# EAGLE design Hava Durumu İst V1.0 (EAGLE 9.6.2)
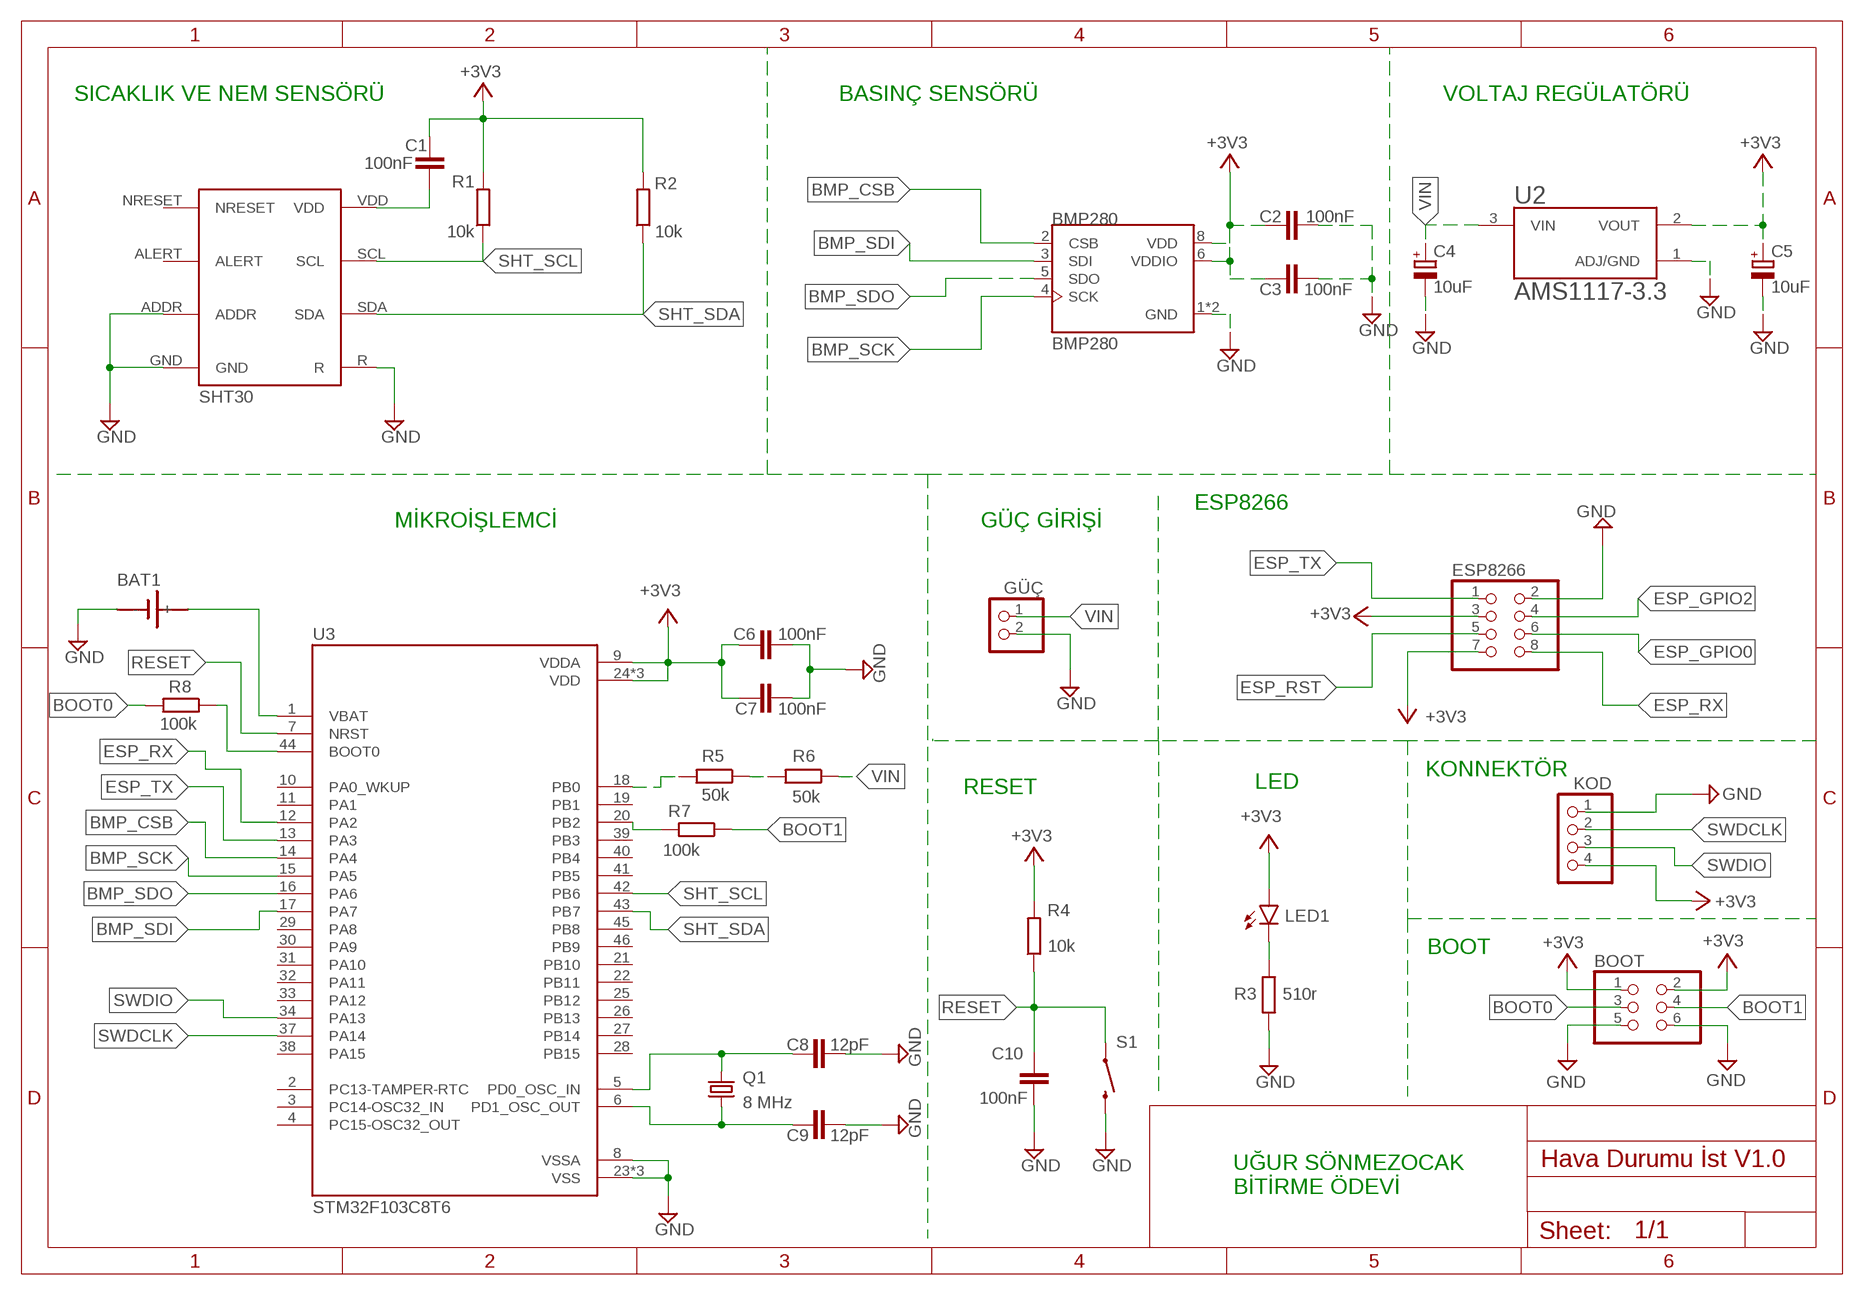
[diagram p0: schematic, sheet 1]

## Parts
BAT1  SN2032  [SN2032]
BMP280  BMP280  [XDCR_BMP280]
BOOT  PINHD-2X3  [2X03]
C1  100nF  C-EUC0805  [C0805]
C2  100nF  C-EUC0805  [C0805]
C3  100nF  C-EUC0805  [C0805]
C4  10uF  CPOL-EUSMCP  [SMC_P]
C5  10uF  CPOL-EUSMCP  [SMC_P]
C6  100nF  C-EUC0805  [C0805]
C7  100nF  C-EUC0805  [C0805]
C8  12pF  C-EUC0805  [C0805]
C9  12pF  C-EUC0805  [C0805]
C10  100nF  C-EUC0805  [C0805]
ESP8266  PINHD-2X4  [2X04]
GÜÇ  PINHD-1X2  [1X02]
KOD  PINHD-1X4/90  [1X04/90]
LED1  LEDCHIP-LED0805  [CHIP-LED0805]
Q1  8 MHz  CRYSTALHC49UP  [HC49UP]
R1  10k  R-EU_R0805  [R0805]
R2  10k  R-EU_R0805  [R0805]
R3  510r  R-EU_R0805  [R0805]
R4  10k  R-EU_R0805  [R0805]
R5  50k  R-EU_R0805  [R0805]
R6  50k  R-EU_R0805  [R0805]
R7  100k  R-EU_R0805  [R0805]
R8  100k  R-EU_R0805  [R0805]
S1  MOMENTARY-SWITCH-SPST-PTH-6.0MM  [TACTILE_SWITCH_PTH_6.0MM]
U2  AMS1117-3.3  [SOT229P700X180-4N]
U3  STM32F103C8T6  [QFP50P900X900X160-48N]
U$1  SHT30  [SON50P250X250X90-9T100X170N]

## Nets
+3V3: BMP280.6(VDDIO) BMP280.8(VDD) BOOT.1 BOOT.2 C1.1 C2.1 C3.1 C5.+ C6.1 C7.1 ESP8266.3 ESP8266.7 KOD.4 LED1.A R1.2 R2.2 R4.2 U2.2(VOUT) U3.9(VDDA) U3.24(VDD) U3.36(VDD) U3.48(VDD)
BMP_CSB: BMP280.2(CSB) U3.14(PA4)
BMP_SCK: BMP280.4(SCK) U3.15(PA5)
BMP_SDI: BMP280.3(SDI) U3.17(PA7)
BMP_SDO: BMP280.5(SDO) U3.16(PA6)
BOOT0: BOOT.3 R8.2
BOOT1: BOOT.4 R7.1
ESP_GPIO0: ESP8266.6
ESP_GPIO2: ESP8266.4
ESP_RST: ESP8266.5
ESP_RX: ESP8266.8 U3.12(PA2)
ESP_TX: ESP8266.1 U3.13(PA3)
GND: BAT1.- BMP280.1(GND) BMP280.7(GND) BOOT.5 BOOT.6 C2.2 C3.2 C4.- C5.- C6.2 C7.2 C8.2 C9.2 C10.1 ESP8266.2 GÜÇ.2 KOD.1 R3.1 S1.3 U2.1(ADJ/GND) U3.8(VSSA) U3.23(VSS) U3.35(VSS) U3.47(VSS) U$1.ADDR U$1.GND U$1.R
N$1: C1.2 U$1.VDD
N$2: C9.1 Q1.1 U3.6(PD1_OSC_OUT)
N$3: C8.1 Q1.2 U3.5(PD0_OSC_IN)
N$4: R5.2 U3.18(PB0)
N$5: R5.1 R6.2
N$6: LED1.C R3.2
N$7: BAT1.+ U3.1(VBAT)
N$10: R8.1 U3.44(BOOT0)
N$11: R7.2 U3.20(PB2)
RESET: C10.2 R4.1 S1.1 U3.7(NRST)
SHT_SCL: R1.1 U3.42(PB6) U$1.SCL
SHT_SDA: R2.1 U3.43(PB7) U$1.SDA
SWDCLK: KOD.2 U3.37(PA14)
SWDIO: KOD.3 U3.34(PA13)
VIN: C4.+ GÜÇ.1 R6.1 U2.3(VIN)
Unconnected: U3.2(PC13-TAMPER-RTC) U3.3(PC14-OSC32_IN) U3.4(PC15-OSC32_OUT) U3.10(PA0_WKUP) U3.11(PA1) U3.19(PB1) U3.21(PB10) U3.22(PB11) U3.25(PB12) U3.26(PB13) U3.27(PB14) U3.28(PB15) U3.29(PA8) U3.30(PA9) U3.31(PA10) U3.32(PA11) U3.33(PA12) U3.38(PA15) U3.39(PB3) U3.40(PB4) U3.41(PB5) U3.45(PB8) U3.46(PB9) U$1.ALERT U$1.NRESET

## Notes on the sheet
- SICAKLIK VE NEM SENSÖRÜ | BASINÇ SENSÖRÜ | VOLTAJ REGÜLATÖRÜ
- ESP8266
- MİKROİŞLEMCİ | GÜÇ GİRİŞİ
- KONNEKTÖR
- RESET | LED
- BOOT
- UĞUR SÖNMEZOCAK
  BİTİRME ÖDEVİ

## Library data of the parts
BAT1 = sn2032:SN2032: LI BATTERY
BMP280 = BMP280:BMP280: BMP280 Absolute Barometric Pressure Sensor for Battery Powered Devices 2 x 2.5mm Check prices <https://pricing.snapeda.com/parts/BMP280/Bosch/view-part?ref=eda>; AVAILABILITY: Warning; DESCRIPTION: Pressure Sensor 4.35PSI ~ 15.95PSI (30kPa ~ 110kPa) Absolute 16b 8-SMD; MF: Bosch; MP: BMP280; PACKAGE: SMD-8 Bosch Sensortec; PRICE: None; PURCHASE-URL: https://pricing.snapeda.com/search/part/BMP280/?ref=eda
BOOT = pinhead:PINHD-2X3: PIN HEADER
C1-C3 C6-C10 = rcl:C-EU: CAPACITOR, European symbol; SPICEPREFIX: C
C4 C5 = rcl:CPOL-EU: POLARIZED CAPACITOR, European symbol; SPICEPREFIX: C
ESP8266 = pinhead:PINHD-2X4: PIN HEADER
GÜÇ = pinhead:PINHD-1X2: PIN HEADER
KOD = pinhead:PINHD-1X4: PIN HEADER
LED1 = led:LED: LED OSRAM: - CHIPLED LG R971, LG N971, LY N971, LG Q971, LY Q971, LO R971, LY R971 LH N974, LH R974 LS Q976, LO Q976, LY Q976 LO Q996 - Hyper CHIPLED LW Q18S LB Q993, LB Q99A, LB R99A - SideLED LS A670, LO A670, LY A670, LG A670, LP A670 LB A673, LV A673, LT A673, LW A673 LH A674 LY A675 LS A676, LA A676, LO A676, LY A676, LW A676 LS A679, LY A679, LG A679 - Hyper Micro SIDELED® LS Y876, LA Y876, LO Y876, LY Y876 LT Y87S - SmartLED LW L88C, LW L88S LB L89C, LB L89S, LG L890 LS L89K, LO L89K, LY L89K LS L896, LA L896, LO L896, LY L896 - TOPLED LS T670, LO T670, LY T670, LG T670, LP T670 LSG T670, LSP T670, LSY T670, LOP T670, LYG T670 LG T671, LOG T671, LSG T671 LB T673, LV T673, LT T673, LW T673 LH T674 LS T676, LA T676, LO T676, LY T676, LB T676, LH T676, LSB T676, LW T676 LB T67C, LV T67C, LT T67C, LS T67K, LO T67K, LY T67K, LW E67C LS E67B, LA E67B, LO E67B, LY E67B, LB E67C, LV E67C, LT E67C LW T67C LS T679, LY T679, LG T679 LS T770, LO T770, LY T770, LG T770, LP T770 LB T773, LV T773, LT T773, LW T773 LH T774 LS E675, LA E675, LY E675, LS T675 LS T776, LA T776, LO T776, LY T776, LB T776 LHGB T686 LT T68C, LB T68C - Hyper Mini TOPLED® LB M676 - Mini TOPLED Santana® LG M470 LS M47K, LO M47K, LY M47K Source: http://www.osram.convergy.de LUXEON: - LUMILED® LXK2-PW12-R00, LXK2-PW12-S00, LXK2-PW14-U00, LXK2-PW14-V00 LXK2-PM12-R00, LXK2-PM12-S00, LXK2-PM14-U00 LXK2-PE12-Q00, LXK2-PE12-R00, LXK2-PE12-S00, LXK2-PE14-T00, LXK2-PE14-U00 LXK2-PB12-K00, LXK2-PB12-L00, LXK2-PB12-M00, LXK2-PB14-N00, LXK2-PB14-P00, LXK2-PB14-Q00 LXK2-PR12-L00, LXK2-PR12-M00, LXK2-PR14-Q00, LXK2-PR14-R00 LXK2-PD12-Q00, LXK2-PD12-R00, LXK2-PD12-S00 LXK2-PH12-R00, LXK2-PH12-S00 LXK2-PL12-P00, LXK2-PL12-Q00, LXK2-PL12-R00 Source: www.luxeon.com KINGBRIGHT: KA-3528ASYC Source: www.kingbright.com
Q1 = crystal:CRYSTAL: CRYSTAL; OC_FARNELL: unknown; OC_NEWARK: unknown
R1-R8 = rcl:R-EU_: RESISTOR, European symbol; SPICEPREFIX: R
S1 = SparkFun-Switches:MOMENTARY-SWITCH-SPST: Momentary Switch (Pushbutton) - SPST Normally-open (NO) SPST momentary switches (buttons, pushbuttons). Variants PTH-12MM - 12mm square, through-hole Momentary Pushbutton Switch - 12mm Square <https://www.sparkfun.com/products/9190> (COM-09190) PTH-6.0MM, PTH-6.0MM-KIT - 6.0mm square, through-hole Mini Pushbutton Switch <https://www.sparkfun.com/products/97> (COM-00097) KIT package intended for soldering kit's - only one side of pads' copper is exposed. PTH-RIGHT-ANGLE-KIT - Right-angle, through-hole Right Angle Tactile Button <https://www.sparkfun.com/products/10791> - Used on SparkFun BigTime Watch Kit <https://www.sparkfun.com/products/11734> SMD-12MM - 12mm square, surface-mount Tactile Button - SMD (12mm) <https://www.sparkfun.com/products/12993> (COM-12993) Used on SparkFun PicoBoard <https://www.sparkfun.com/products/11888> SMD-4.5MM - 4.5mm Square Trackball Switch Used on SparkFun Blackberry Trackballer Breakout <https://www.sparkfun.com/products/13169> SMD-4.6MMX2.8MM - 4.60mm x 2.80mm, surface mount Used on SparkFun SAMD21 Mini Breakout <https://www.sparkfun.com/products/13664> SMD-5.2MM, SMD-5.2-REDUNDANT - 5.2mm square, surface-mount Mini Pushbutton Switch - SMD <https://www.sparkfun.com/products/8720> (COM-08720) Used on Arduino Pro Mini <https://www.sparkfun.com/products/11114> REDUNDANT package connects both switch circuits together SMD-6.0X3.5MM - 6.0 x 3.5mm, surface mount Momentary Reset Switch SMD <https://www.sparkfun.com/products/8229> (COM-08229) SMD-6.2MM-TALL - 6.2mm square, surface mount Tactile Button - SMD (6mm) <https://www.sparkfun.com/products/12992> Used on SparkFun Digital Sandbox <https://www.sparkfun.com/products/12651> SMD-RIGHT-ANGLE - Right-angle, surface mount Used on SparkFun Block for Intel® Edison - Arduino <https://www.sparkfun.com/products/13036>; PROD_ID: SWCH-08441; SF_SKU: COM-00097
U2 = AMS1117-3.3:AMS1117-3.3: Sot223/Pkg 1-Amp 3.3-Volt Low Drop Out Voltage Regulatator; AVAILABILITY: Unavailable; DESCRIPTION: LDO Voltage Regulators 800MA LDO LINEAR REG; MF: Advanced Monolithic Systems; MP: AMS1117-3.3; PACKAGE: SOT-89 ams; PRICE: None
U3 = STM32F103C8T6:STM32F103C8T6: Mainstream Performance line, ARM Cortex-M3 MCU with 64 Kbytes Flash, 72 MHz CPU, motor control, USB and CAN; AVAILABILITY: Unavailable; DESCRIPTION: STM32F1 Microcontroller IC 32-Bit 72MHz 64KB (64K x 8) FLASH; MF: STMicroelectronics; MP: STM32F103C8T6; PACKAGE: LQFP-48 STMicroelectronics; PRICE: None
U$1 = Ugur:SHT30

## Board
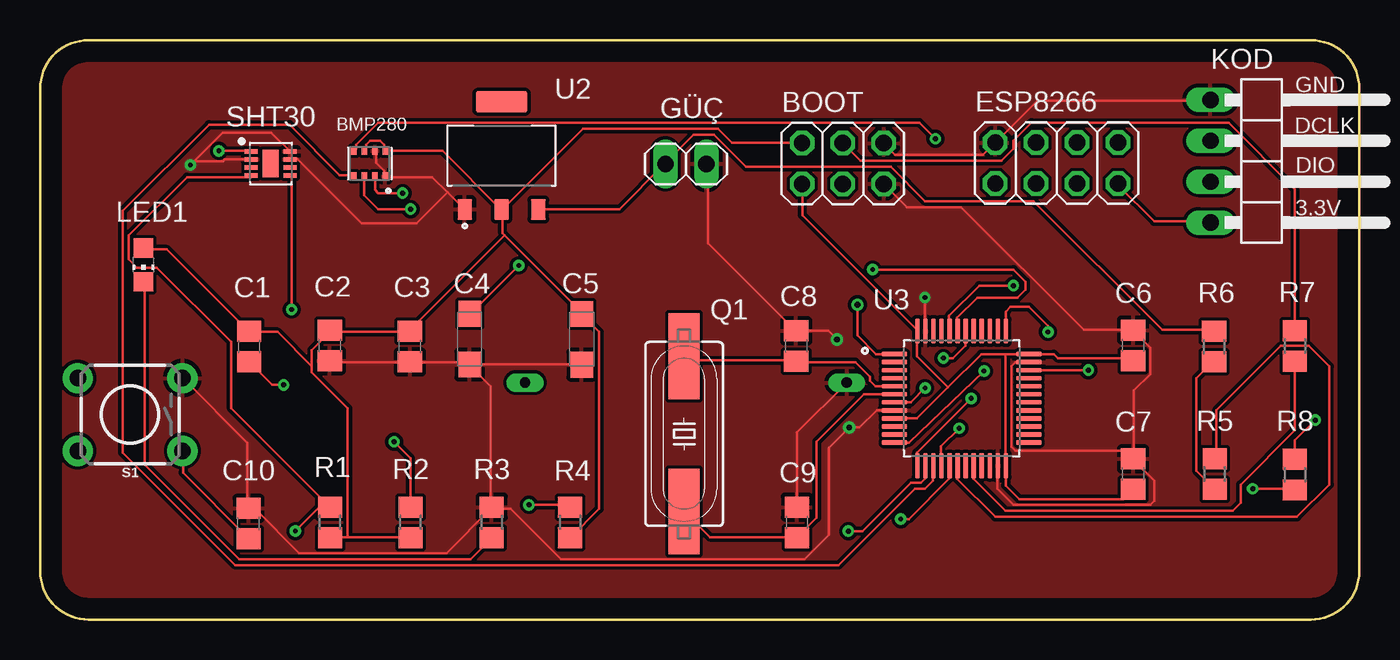
[diagram p1: board, top side]
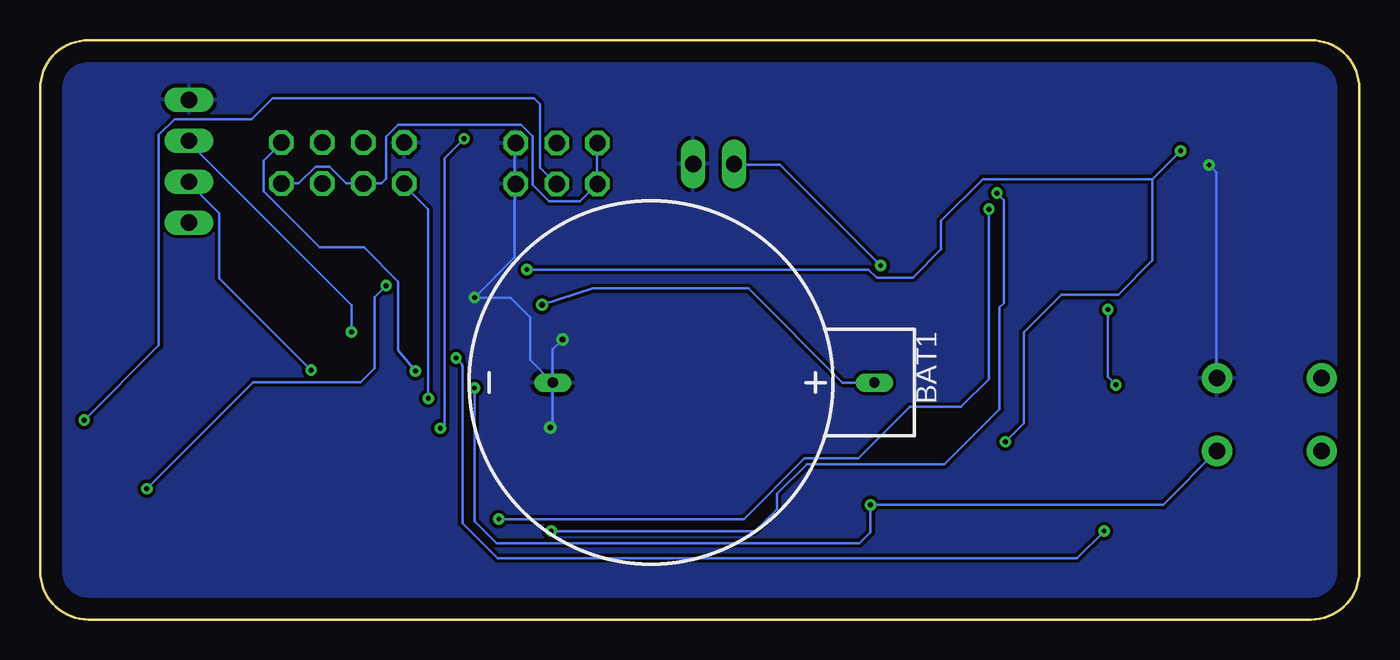
[diagram p2: board, bottom side, seen from below]

Size 82 x 36 mm. Coordinates in mm from the lower left corner, seen from the top.
Outline: 0,33 arc-90 3,36 79,36 arc-90 82,33 82,3 arc-90 79,0 3,0 arc-90 0,3 0,33
Copper layers (1*16): Top 0.035mm / dielectric 1.5mm / Bottom 0.035mm
Design rules "PCBway *": minimum track width 6mil, minimum drill 0.3mm, track to track 0.205mm, track to pad 0.205mm, pad to pad 0.205mm, via to via 0.205mm, smd to smd 8mil, copper to edge 50mil, drill to drill 10mil, minimum pad ring 10mil, minimum via ring 8mil, stop-mask expansion 4mil, vias tented up to drill 25mil, thermal gap 10mil

### Footprints (pad centres in the part's own frame; a part is rotated, then mirrored left to right if it is on the bottom)
SN2032 = drill 0.65 long: + 0,13.9; - 0,-6.1
XDCR_BMP280 = smd 0.5 x 0.35: 1 0.8,0.975; 2 0.8,0.325; 3 0.8,-0.325; 4 0.8,-0.975; 5 -0.8,-0.975; 6 -0.8,-0.325; 7 -0.8,0.325; 8 -0.8,0.975
2X03 = drill 1.016 octagon: 1 -2.54,-1.27; 2 -2.54,1.27; 3 0,-1.27; 4 0,1.27; 5 2.54,-1.27; 6 2.54,1.27
C0805 = smd 1.3 x 1.5: 1 -0.95,0; 2 0.95,0
SMC_P = smd 1.6 x 1.4: + -1.575,0; - 1.575,0
2X04 = drill 1.016 octagon: 1 -3.81,-1.27; 2 -3.81,1.27; 3 -1.27,-1.27; 4 -1.27,1.27; 5 1.27,-1.27; 6 1.27,1.27; 7 3.81,-1.27; 8 3.81,1.27
1X02 = drill 1.016 long: 1 -1.27,0; 2 1.27,0
1X04/90 = drill 1.016 long: 1 -3.81,-3.81; 2 -1.27,-3.81; 3 1.27,-3.81; 4 3.81,-3.81
CHIP-LED0805 = smd 1.2 x 1.2: A 0,-1.05; C 0,1.05
HC49UP = smd 5.334 x 1.93: 1 -4.826,0; 2 4.826,0
R0805 = smd 1.3 x 1.5: 1 -0.95,0; 2 0.95,0
TACTILE_SWITCH_PTH_6.0MM = drill 1.016 pad 1.88: 1 -3.251,2.261; 2 3.251,2.261; 3 -3.251,-2.261; 4 3.251,-2.261
SOT229P700X180-4N = smd 0.93 x 1.31: 1 -2.29,-3.345; 2 0,-3.345; 3 2.29,-3.345 | smd 3.24 x 1.31: 4 0,3.345
QFP50P900X900X160-48N = smd 1.56 x 0.28: 1 -4.18,2.75; 2 -4.18,2.25; 3 -4.18,1.75; 4 -4.18,1.25; 5 -4.18,0.75; 6 -4.18,0.25; 7 -4.18,-0.25; 8 -4.18,-0.75; 9 -4.18,-1.25; 10 -4.18,-1.75; 11 -4.18,-2.25; 12 -4.18,-2.75; 25 4.18,-2.75; 26 4.18,-2.25; 27 4.18,-1.75; 28 4.18,-1.25; 29 4.18,-0.75; 30 4.18,-0.25; 31 4.18,0.25; 32 4.18,0.75; 33 4.18,1.25; 34 4.18,1.75; 35 4.18,2.25; 36 4.18,2.75 | smd 0.28 x 1.56: 13 -2.75,-4.18; 14 -2.25,-4.18; 15 -1.75,-4.18; 16 -1.25,-4.18; 17 -0.75,-4.18; 18 -0.25,-4.18; 19 0.25,-4.18; 20 0.75,-4.18; 21 1.25,-4.18; 22 1.75,-4.18; 23 2.25,-4.18; 24 2.75,-4.18; 37 2.75,4.18; 38 2.25,4.18; 39 1.75,4.18; 40 1.25,4.18; 41 0.75,4.18; 42 0.25,4.18; 43 -0.25,4.18; 44 -0.75,4.18; 45 -1.25,4.18; 46 -1.75,4.18; 47 -2.25,4.18; 48 -2.75,4.18
SON50P250X250X90-9T100X170N = smd 0.81 x 0.27: ADDR -1.21,0.25; ALERT -1.21,-0.25; GND 1.21,0.75; NRESET 1.21,-0.25; R 1.21,0.25; SCL -1.21,-0.75; SDA -1.21,0.75; VDD 1.21,-0.75 | smd 1 x 1.7: PAD 0,0

### Placement (x,y rotation side)
BAT1  44.04,14.73 270 bottom
BMP280  20.48,28.34 270 top
BOOT  49.9,28.34 0 top
C1  12.99,16.96 270 top
C2  18.01,17.03 270 top
C3  22.98,16.96 270 top
C4  26.7,17.42 270 top
C5  33.67,17.41 270 top
C6  67.94,17.04 90 top
C7  67.94,9.04 90 top
C8  46.99,16.99 90 top
C9  47.04,6.04 90 top
C10  12.95,5.96 270 top
ESP8266  63.19,28.37 0 top
GÜÇ  40.14,28.31 0 top
KOD  76.56,28.48 270 top
LED1  6.42,22.04 180 top
Q1  40.03,11.54 90 top
R1  18.02,6.04 270 top
R2  23.02,6.04 270 top
R3  28.07,6.04 270 top
R4  32.94,6.04 270 top
R5  73.01,9.04 90 top
R6  72.98,16.96 270 top
R7  78,17 270 top
R8  78,9 90 top
S1  5.59,12.74 180 top
U2  28.68,28.83 0 top
U3  57.28,13.75 0 top
U$1  14.34,28.34 0 top

### Tracks (layer width: path | path; a pad name or v marks a point on that pad's centre or on a via)
+3V3
  Top 0.152: KOD.4 72.75,24.75 69.25,24.75 67,27 ESP8266.7 | C7.1 67.34,7.49 60.87,7.49 60.03,8.32 U3.24 60,9.62 60,16.5 | C6.1 67.64,16.25 63.25,16.25 63,16.5 61.5,16.5 U3.36 61.38,16.5 60,16.5 | 56.43,14.43 58.5,16.5 60,16.5 | 56.43,14.43 54.5,12.5 53.12,12.5 U3.9 | 56.43,14.43 54.5,16.36 54.5,17.88 U3.48 54.5,18 47.38,25.12 47.38,27 BOOT.1 | LED1.A 6.5,23 7.88,23 12.88,18 C1.1 13,17.88 14.75,17.88 16.88,15.75 | 19.12,5.12 18.12,5.12 R1.2 | 19.12,5.12 23,5.12 R2.2 | 19.12,5.12 19.12,13.12 16.88,15.38 16.88,15.75 | 16.88,15.75 16.88,16.75 18,17.88 C2.1 18.12,17.88 22.88,17.88 C3.1 23,18 28.88,23.88 | BMP280.6 20.25,29.25 20.25,29.5 20.5,29.75 21.12,29.75 21.38,29.5 21.38,29.25 BMP280.8 21.5,29.12 25,29.12 28.62,25.5 U2.2 | R4.2 33,5.12 34.75,6.88 34.75,17.88 33.75,18.88 C5.+ 33.75,19 28.88,23.88 | 28.88,23.88 28.75,24 28.75,25.38 U2.2 | BOOT.2 47.25,29.62 43,29.62 42.12,30.5 33.75,30.5 28.75,25.5 U2.2
  Bottom 0.152: BOOT.2 47.38,29.5 47.38,27.12 47.36,27.11 BOOT.1 48.43,26 50.38,26 51.39,27.02 51.39,30.04 52.1,30.75 59.75,30.75 60.5,30 60.5,27.38 60.78,27.1 ESP8266.3 62.98,27.1 64.02,28.14 64.89,28.14 65.93,27.1 ESP8266.7
BMP_CSB  (via drill 0.3)
  Top 0.152: v50.24,5.5 51.12,5.5 54.12,8.5 54.75,8.5 55,8.75 55,9.5 U3.14 | v22.53,26.5 21,26.5 20.8,26.69 BMP280.2
  Bottom 0.152: v50.24,5.5 37.56,5.5 36.2,6.86 36.2,7.8 34.35,9.65 25.78,9.65 22.36,13.07 22.36,19.4 22.1,19.66 22.1,26.07 v22.53,26.5
BMP_SCK
  Top 0.152: BMP280.4 19.5,27.62 18.62,27.62 15.49,30.76 10.49,30.76 5.12,25.39 5.12,10.38 12.12,3.38 49.62,3.38 54.38,8.12 55,8.12 55.5,8.62 55.5,9.5 U3.15
BMP_SDI  (via drill 0.3)
  Top 0.152: v23.03,25.5 21,25.5 20.12,26.38 20.12,27.5 BMP280.3 | v53.5,6.25 54,6.25 56.5,8.75 56.5,9.5 U3.17
  Bottom 0.152: v23.03,25.5 23.03,23.62 23.03,23.6 23.03,14.95 24.77,13.21 27.94,13.21 31.14,10.01 34.5,10.01 38.26,6.25 v53.5,6.25
BMP_SDO  (via drill 0.3)
  Top 0.152: v55.65,29.88 54.66,30.88 21,30.88 19.62,29.5 19.62,29.25 BMP280.5 | v57.13,11.89 56,10.76 56,9.62 U3.16
  Bottom 0.152: v55.65,29.88 56.88,28.65 56.88,12.14 v57.13,11.89
BOOT0  (via drill 0.3)
  Top 0.152: R8.2 78,11.13 v79.26,12.39
  Bottom 0.152: v79.26,12.39 74.62,17.03 74.62,30.12 73.65,31.1 68.85,31.1 67.56,32.38 51.31,32.38 50.94,32.02 50.94,29.18 50.94,28.06 50,27.12 BOOT.3
BOOT1
  Top 0.152: R7.1 78,26.75 73.88,30.88 61.62,30.88 60.5,29.75 60.5,29.25 59.75,28.5 51,28.5 50,29.5 BOOT.4
ESP_RX  (via drill 0.3)
  Top 0.152: v58.67,15.44 54,11 53.12,11 U3.12
  Bottom 0.152: v58.67,15.44 59.75,16.75 59.75,21 61.88,23.12 64.62,23.12 68.12,26.62 68.12,28.5 67,29.62 ESP8266.8
ESP_TX  (via drill 0.3)
  Top 0.152: v57.87,13.75 54.5,10.37 54.5,9.62 U3.13
  Bottom 0.152: v57.87,13.75 57.87,25.5 59.38,27 ESP8266.1
GND  (via drill 0.3, 0.35)
  Top 0.152: 15.62,28.62 15.62,29 U$1.GND 15.5,29.12 14.37,30.26 11.34,30.26 9.58,28.5 9.58,28.49 | BMP280.7 20.88,29.12 20.88,28.38 21.38,27.88 21.38,27.62 BMP280.1 21.5,27.5 24.38,27.5 25.33,26.55 | U2.1 25.33,26.55 | 15.62,28.62 15.98,28.62 19.98,24.62 23.41,24.62 25.33,26.55 | 15.62,28.62 U$1.R | S1.3 8.88,15 12.88,11 12.88,7 C10.1 13,6.88 13.36,6.88 16.11,4.12 25.25,4.12 28,6.88 R3.1 | C2.2 18.12,16 22.88,16 C3.2 23,16 26.5,16 26.62,15.88 C4.- | R3.1 28,7 28,14.5 26.75,15.75 C4.- | C5.- 33.62,15.88 26.75,15.88 C4.- | U3.8 53,13 52,13 50.94,11.94 v50.29,11.94 49.02,10.67 49.02,5.27 47.5,3.75 32.38,3.75 29.25,6.88 28.12,6.88 R3.1 | v55,20.01 55,18 U3.47 | GÜÇ.2 41.5,28.25 41.5,23.38 46.88,18 C8.2 48.99,17.94 v49.53,17.4 | 68,10.5 68,14.25 69,15.25 69,16.88 68,17.88 C6.2 67.88,18 64.88,18 57.25,25.62 53.88,25.62 52.5,27 BOOT.5 | 68,10.5 68,10 C7.2 | U3.23 59.5,9.5 59.5,8.12 60.49,7.12 69,7.12 69.25,7.38 69.25,8.62 68,9.88 C7.2 | 68,10.5 60.62,10.5 60.38,10.75 60.38,15.75 60.62,16 61.38,16 U3.35 | 68,10.5 C7.2 | BOOT.6 52.5,29.5 53.13,28.87 58.61,28.87 ESP8266.2 59.5,29.75 62,32.25 72.75,32.25 KOD.1 | U$1.ADDR 11.47,28.59 11.37,28.49 9.58,28.49 | 9.58,28.49 v9.34,28.25 | C9.2 47.04,11.63 BAT1.-
  Bottom 0.152: v9.34,28.25 8.88,27.78 8.88,15.12 S1.3 | BOOT.6 52.5,29.5 52.5,27.12 BOOT.5 52.5,27 52.5,22.51 v55,20.01 52.78,20.01 51.56,18.8 51.56,16.15 BAT1.- | BAT1.- 50.14,16.79 v49.53,17.4 | BAT1.- 50.14,12.09 v50.29,11.94
  pour Top: 0,36 0,0 82,0 82,36
  pour Bottom: -1,37 -1,-1 83,-1 83,37
N$1  (via drill 0.3)
  Top 0.152: U$1.VDD 15.63,27.51 v15.63,19.27 | C1.2 14.41,14.59 v15.14,14.59
  Bottom 0.152: v15.63,19.27 15.63,15.07 v15.14,14.59
N$2
  Top 0.152: Q1.1 40.12,6.62 41.62,5.12 47,5.12 C9.1 48.26,6.31 48.26,11.05 51.21,14 53,14 U3.6
N$3
  Top 0.152: Q1.2 40.12,16.25 40.25,16.12 46.88,16.12 C8.1 47,16 50.66,16 51.58,15.09 51.58,14.84 51.92,14.5 U3.5
N$4
  Top 0.152: R5.2 73.12,10 73.12,13 77.12,17 78.88,17 80.14,15.74 80.14,8.39 78.12,6.38 59.38,6.38 57,8.75 57,9.5 U3.18
N$5
  Top 0.152: R5.1 73,8.12 71.88,9.25 71.88,15 72.88,16 R6.2
N$6
  Top 0.152: LED1.C 6.5,20.88 6.5,9.62 12.38,3.75 26.75,3.75 28,5 R3.2
N$7  (via drill 0.35)
  Top 0.152: v50.8,19.56 50.8,17.65 51.96,16.5 U3.1
  Bottom 0.152: v50.8,19.56 47.62,20.57 37.97,20.57 32.13,14.73 BAT1.+
N$10  (via drill 0.3)
  Top 0.152: v75.38,8.12 78,8.12 R8.1 | v60.5,20.75 58.38,20.75 56.5,18.88 56.5,18 U3.44
  Bottom 0.152: v75.38,8.12 68.75,14.75 62.09,14.75 61.21,15.62 61.21,20.04 v60.5,20.75
N$11
  Top 0.152: R7.2 78,11.75 74.63,8.38 74.63,7.25 74.14,6.75 60,6.75 58,8.75 58,9.5 U3.20
RESET  (via drill 0.3)
  Top 0.152: C10.2 12.88,5.12 8.88,9.12 8.88,10.38 S1.1 | v30.38,7.13 32.2,7.13 R4.1 | U3.7 54.12,13.5 v55.01,14.39
  Bottom 0.152: v55.01,14.39 55.01,6.12 53.63,4.75 31.06,4.75 30.38,5.43 v30.38,7.13 12.19,7.13 S1.1
SHT_SCL  (via drill 0.3)
  Top 0.152: U$1.SCL 13.12,27.5 9.12,27.5 5.5,23.88 5.5,22.38 6,21.88 7.25,21.88 11.88,17.25 11.88,13.12 18,7 R1.1 17.35,6.99 v15.86,5.5 | v56.14,16.25 56.75,16.25 57.5,17 57.5,17.88 U3.42
  Bottom 0.152: v56.14,16.25 55.76,15.87 55.76,15.76 55.76,15.75 55.76,5.99 53.57,3.81 17.55,3.81 v15.86,5.5
SHT_SDA  (via drill 0.3)
  Top 0.152: v11.11,29.12 13.12,29.12 U$1.SDA | R2.1 23.02,10.03 v22,11.05 | v51.75,21.75 60.5,21.75 61.25,21 61.25,20.5 60.75,20 58.25,20 57,18.75 57,18 U3.43
  Bottom 0.152: 12.86,27.38 v11.11,29.12 | v22,11.05 20.86,12.19 20.86,17.85 18.52,20.19 14.99,20.19 12.86,22.32 12.86,27.38 | v51.75,21.75 30.5,21.75 30,21.25 27.75,21.25 26,23 26,24.79 23.41,27.38 12.86,27.38
SWDCLK  (via drill 0.3)
  Top 0.152: U3.37 60.03,19.14 60.33,19.43 61.47,19.43 62.65,18.25 v62.65,17.87
  Bottom 0.152: v62.65,17.87 62.65,19.52 72.75,29.63 KOD.2
SWDIO  (via drill 0.3)
  Top 0.152: v65.16,15.5 61.5,15.5 U3.34
  Bottom 0.152: v65.16,15.5 70.88,21.21 70.88,25.25 72.75,27.12 KOD.3
VIN  (via drill 0.3)
  Top 0.152: U2.3 31,25.5 36,25.5 38.75,28.25 GÜÇ.1 38.88,28.38 40.62,30.12 41.88,30.12 43.88,28.12 52.88,28.12 55,26 61.75,26 69.75,18 72.88,18 R6.1 | v29.75,22 26.75,19 C4.+
  Bottom 0.152: v29.75,22 36,28.25 38.75,28.25 GÜÇ.1

### Text on the board
tNames: GND | DCLK | DIO | 3.3V